# Altium project MINIQUAD.PrjPcb
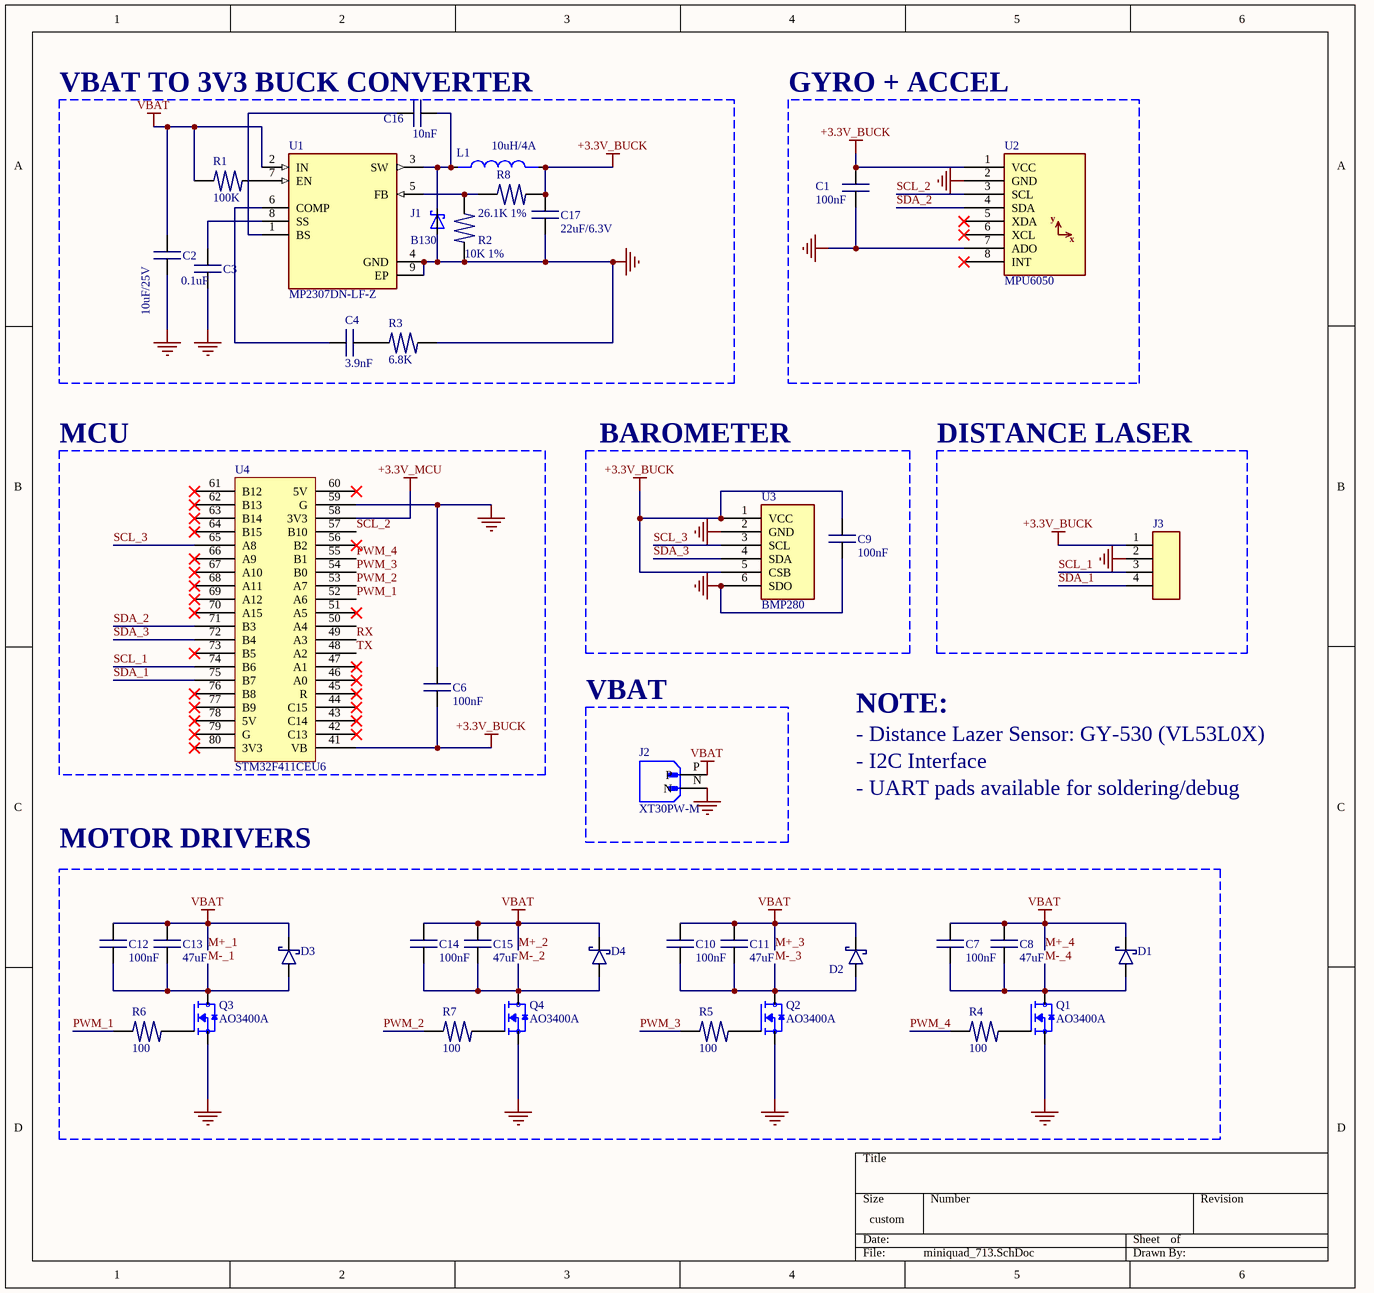
[diagram p0: miniquad_713.SchDoc]
1 sheet, 40 parts. Net scope: global (net labels, ports and power ports of the same name join across sheets).
Board file: miniquad_713.PcbDoc

## Sheet miniquad_713.SchDoc
size 254 x 241 mm; SheetNumber: 1; SheetTotal: 1

### Parts
C1  100nF  [CAPACITOR 0603]
C2  10uF/25V  [CAPACITOR 0603]
C3  0.1uF  [CAPACITOR 0603]
C4  3.9nF  [CAPACITOR 0603]
C6  100nF  [CAPACITOR 0603]
C7  100nF  [CAPACITOR 0805]
C8  47uF  [CAPACITOR 0805]
C9  100nF  [CAPACITOR 0603]
C10  100nF  [CAPACITOR 0805]
C11  47uF  [CAPACITOR 0805]
C12  100nF  [CAPACITOR 0805]
C13  47uF  [CAPACITOR 0805]
C14  100nF  [CAPACITOR 0805]
C15  47uF  [CAPACITOR 0805]
C16  10nF  [CAPACITOR 0603]
C17  22uF/6.3V  [CAPACITOR 0603]
D1  SS14  [DIODE_SMA]  (value not drawn)
D2  SS14  [DIODE_SMA]  (value not drawn)
D3  SS14  [DIODE_SMA]  (value not drawn)
D4  SS14  [DIODE_SMA]  (value not drawn)
J1  B130  [SMA]
J2  XT30PW-M  [AMASS_XT30PW-M]
J3  MALE-2.54-4P  [MALE-2.54-4P]  (value not drawn)
L1  10uH/4A  [CUON CAM SMD 0530]
Q1  AO3400A  [SOT95P280X125-3N]
Q2  AO3400A  [SOT95P280X125-3N]
Q3  AO3400A  [SOT95P280X125-3N]
Q4  AO3400A  [SOT95P280X125-3N]
R1  100K  [RESISTOR_0603]
R2  10K 1%  [RESISTOR_0603]
R3  6.8K  [RESISTOR_0603]
R4  100  [RESISTOR_0603]
R5  100  [RESISTOR_0603]
R6  100  [RESISTOR_0603]
R7  100  [RESISTOR_0603]
R8  26.1K 1%  [RESISTOR_0603]
U1  MP2307DN-LF-Z  [SOIC127P600X170-9N]
U2  MPU6050  [MPU6050]
U3  BMP280  [BMP280]
U4  STM32F411CEU6  [STM32F411CEU6]

### Blocks framed on the sheet
VBAT TO 3V3 BUCK CONVERTER: C2-C4 C16 C17 J1 L1 R1-R3 R8 U1
GYRO + ACCEL: C1 U2
MCU: C6 U4
BAROMETER: C9 U3
DISTANCE LASER: J3
VBAT: J2
MOTOR DRIVERS: C7 C8 C10-C15 D1-D4 Q1-Q4 R4-R7

### Nets
+3.3V_BUCK: C1.2 C6.1 C9.2 C17.2 J3.1 L1.2 R8.2 U2.1(VCC) U3.1(VCC) U3.5(CSB) U4.41(VB)
+3.3V_MCU: U4.58(3V3)
GND: C1.1 C2.2 C3.2 C6.2 C9.1 C17.1 J1.A J2.N J3.2 Q1.2(S) Q2.2(S) Q3.2(S) Q4.2(S) R2.2 R3.1 U1.4(GND) U1.9(EP) U2.2(GND) U2.7(ADO) U3.2(GND) U3.6(SDO) U4.59(G)
M+_1: C2.1 C7.2 C8.2 C10.2 C11.2 C12.2 C13.2 C14.2 C15.2 D1.2 D2.2 D3.2 D4.2 J2.P R1.2 U1.2(IN)  [also labelled M+_2, M+_3, M+_4, VBAT]
M-_1: C12.1 C13.1 D3.1 Q3.3(D)
M-_2: C14.1 C15.1 D4.1 Q4.3(D)
M-_3: C10.1 C11.1 D2.1 Q2.3(D)
M-_4: C7.1 C8.1 D1.1 Q1.3(D)
PWM_1: R6.2 U4.52(A6)
PWM_2: R7.2 U4.53(A7)
PWM_3: R5.2 U4.54(B0)
PWM_4: R4.2 U4.55(B1)
RX: U4.49(A3)
SCL_1: J3.3 U4.74(B6)
SCL_2: U2.3(SCL) U4.57(B10)
SCL_3: U3.3(SCL) U4.65(A8)
SDA_1: J3.4 U4.75(B7)
SDA_2: U2.4(SDA) U4.71(B3)
SDA_3: U3.4(SDA) U4.72(B4)
TX: U4.48(A2)
NetC3_1: C3.1 U1.8(SS)
NetC4_1: C4.1 U1.6(COMP)
NetC4_2: C4.2 R3.2
NetC16_1: C16.1 U1.1(BS)
NetC16_2: C16.2 J1.C L1.1 U1.3(SW)
NetQ1_1: Q1.1(G) R4.1
NetQ2_1: Q2.1(G) R5.1
NetQ3_1: Q3.1(G) R6.1
NetQ4_1: Q4.1(G) R7.1
NetR1_1: R1.1 U1.7(EN)
NetR2_1: R2.1 R8.1 U1.5(FB)

Not connected (* = marked no-connect by the designer): U2 5(XDA)* 6(XCL)* 8(INT)*; U4 42(C13)* 43(C14)* 44(C15)* 45(R)* 46(A0)* 47(A1)* 50(A4) 51(A5)* 56(B2)* 60(5V)* 61(B12)* 62(B13)* 63(B14)* 64(B15)* 66(A9)* 67(A10)* 68(A11)* 69(A12)* 70(A15)* 73(B5)* 76(B8)* 77(B9)* 78(5V)* 79(G)* 80(3V3)*

### Notes on the sheet
- NOTE:
- - Distance Lazer Sensor: GY-530 (VL53L0X)
- - I2C Interface
- - UART pads available for soldering/debug
- (in symbol MPU6050) y; x

### Library data of the parts
C1-C4 C6 C9 C16 C17 = CAPACITOR 0603: Generic Capacitor 0603, 1.6x0.8x0.9mm.
C7 C8 C10-C15 = CAPACITOR 0805: Generic Capacitor 0805, 2x1.25x1.4mm.
D1-D4 = SS14: Rectifier Schottky 40V 1A SMA; Mouser PN: 512-SS14; ComponentLink1Description: Datasheet; Digikey PN: SS14-E3/5ATGITR-ND; JLCPCB PN: C2837270
J1 = B130-13-F: Diode Zener Dual 3.9V 5% 300mW 3Pin | Diodes Inc B130-13-F; MF: Diodes Inc.; SnapEDA_Link: https://www.snapeda.com/parts/B130-13-F/Diodes+Inc./view-part/?ref=snap; Package: DO-214 Diodes Inc.; Value: *; MP: B130-13-F; Check_prices: https://www.snapeda.com/parts/B130-13-F/Diodes+Inc./view-part/?ref=eda
J2 = XT30PW-M: Socket; DC supply; XT30; male; PIN: 2; on PCBs; THT; Colour: yellow; MF: AMASS; SnapEDA_Link: https://www.snapeda.com/parts/XT30PW-M/AMASS/view-part/?ref=snap; Package: None; Value: *; MP: XT30PW-M; Check_prices: https://www.snapeda.com/parts/XT30PW-M/AMASS/view-part/?ref=eda
J3 = MALE-2.54-4P: Male Header Connector 2.54mm 4 Pins.; JLCPCB PN: C492403
L1 = Cuon Cam SMD 0530: SMD 0530; MP: FDV0530-H-1R5M=P3; Package: None; Price: None; Value: *; Availability: Unavailable
Q1-Q4 = AO3400A: N-Channel 30 V 5.8A (Ta) 1.4W (Ta) Surface Mount SOT-23; MF: UMW; SnapEDA_Link: https://www.snapeda.com/parts/AO3400A/UMW/view-part/?ref=snap; Package: None; Value: *; MP: AO3400A; Check_prices: https://www.snapeda.com/parts/AO3400A/UMW/view-part/?ref=eda
R1-R8 = RESISTOR_0603: Generic Resistor 0603.
U1 = MP2307DN-LF-Z: Buck Switching Regulator IC Positive Adjustable 0.925V 1 Output 3A 8-SOIC (0.154, 3.90mm Width) Exposed Pad; MF: Monolithic Power; Check_prices: https://www.snapeda.com/parts/MP2307DN-LF-Z/Monolithic+Power+Systems+Inc./view-part/?ref=eda; SnapEDA_Link: https://www.snapeda.com/parts/MP2307DN-LF-Z/Monolithic+Power+Systems+Inc./view-part/?ref=snap; Availability: In Stock; Value: *; Price: None; MP: MP2307DN-LF-Z; Package: SOIC-8 Monolithic Power; Purchase-URL: https://pricing.snapeda.com/search/part/MP2307DN-LF-Z/?ref=eda
U2 = MPU6050: IMU ACCEL/GYRO 3-AXIS I2C; ComponentLink1Description: Datasheet; ComponentLink1URL: https://invensense.tdk.com/wp-content/uploads/2015/02/MPU-6000-Datasheet1.pdf
U3 = BMP280: SENSOR ATMOSPHERIC PRESSURE/TEMPERATURE/ALTITUDE